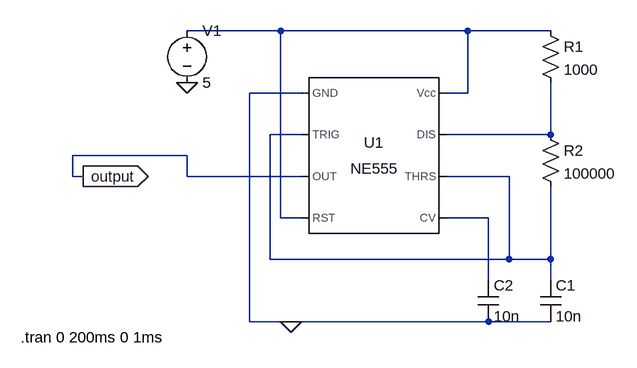
[diagram p0: schematic Draft1.asc]
Draft1.asc, the LTspice schematic file:
Version 4
SHEET 1 880 680
WIRE 48 -64 -96 -64
WIRE 336 -64 48 -64
WIRE 464 -64 336 -64
WIRE 80 32 0 32
WIRE 336 32 336 -64
WIRE 336 32 304 32
WIRE 80 96 32 96
WIRE 464 96 464 16
WIRE 464 96 304 96
WIRE -96 128 -272 128
WIRE -272 160 -272 128
WIRE -256 160 -272 160
WIRE -96 160 -96 128
WIRE 80 160 -96 160
WIRE 400 160 304 160
WIRE 48 224 48 -64
WIRE 80 224 48 224
WIRE 368 224 304 224
WIRE 32 288 32 96
WIRE 400 288 400 160
WIRE 400 288 32 288
WIRE 464 288 464 176
WIRE 464 288 400 288
WIRE 368 320 368 224
WIRE 464 320 464 288
WIRE 0 384 0 32
WIRE 64 384 0 384
WIRE 368 384 64 384
WIRE 464 384 368 384
FLAG 64 384 0
FLAG -256 160 output
IOPIN -256 160 Out
FLAG -96 16 0
SYMBOL res 448 -80 R0
SYMATTR InstName R1
SYMATTR Value 1000
SYMBOL res 448 80 R0
SYMATTR InstName R2
SYMATTR Value 100000
SYMBOL cap 448 320 R0
SYMATTR InstName C1
SYMATTR Value 10n
SYMBOL cap 352 320 R0
SYMATTR InstName C2
SYMATTR Value 10n
SYMBOL Misc\\NE555 192 128 R0
SYMATTR InstName U1
SYMBOL voltage -96 -80 R0
SYMATTR InstName V1
SYMATTR Value 5
TEXT -352 408 Left 2 !.tran 0 200ms 0 1ms

The netlist it stands for:
* Draft1.asc
R1 N001 N003 1000
R2 N003 N002 100000
C1 N002 0 10n
C2 N004 0 10n
XU1 0 N002 output N001 N004 N002 N003 N001 NE555  ; pins GND TRIG OUT RST CV THRS DIS Vcc
V1 N001 0 5
.tran 0 200ms 0 1ms
.lib NE555.sub
.backanno
.end